# Altium schematic sheet Display Driver.SchDoc
size 431 x 279 mm; SheetNumber: 3; SheetTotal: 7
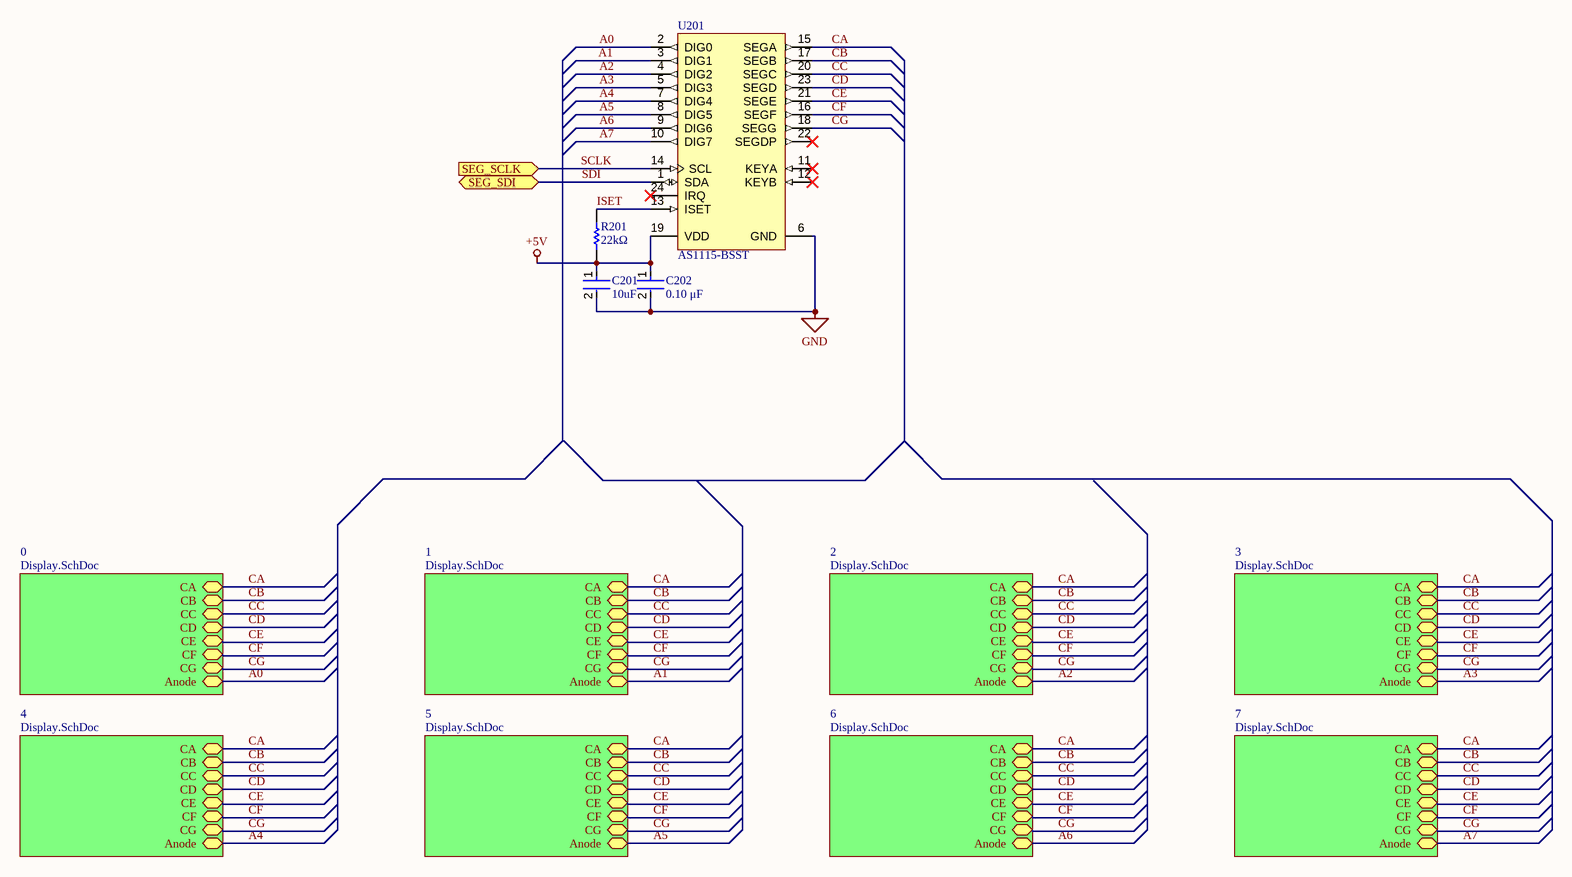
[diagram p0: Display Driver.SchDoc]

## Parts
C201  Capacitance: 10uF  [FP-C1206C-EH-MFG]  (hidden comment: C1206C106K4RACAUTO)
C202  Capacitance: 0.10 μF  [FP-C0603C-CF-MFG]  (hidden comment: C0603C104K5RACAUTO)
R201  Resistance: 22kΩ  [RESC1608X55X25LL10T15]  (hidden comment: RC0603FR-0722KL)
U201  AS1115-BSST  [AMS-QSOP-24-8645X3900DE_N]

## Sub-sheets
0 = Display.SchDoc: CA (bidir), CB (bidir), CC (bidir), CD (bidir), CE (bidir), CF (bidir), CG (bidir), Anode (bidir)
1 = Display.SchDoc: CA (bidir), CB (bidir), CC (bidir), CD (bidir), CE (bidir), CF (bidir), CG (bidir), Anode (bidir)
2 = Display.SchDoc: CA (bidir), CB (bidir), CC (bidir), CD (bidir), CE (bidir), CF (bidir), CG (bidir), Anode (bidir)
3 = Display.SchDoc: CA (bidir), CB (bidir), CC (bidir), CD (bidir), CE (bidir), CF (bidir), CG (bidir), Anode (bidir)
4 = Display.SchDoc: CA (bidir), CB (bidir), CC (bidir), CD (bidir), CE (bidir), CF (bidir), CG (bidir), Anode (bidir)
5 = Display.SchDoc: CA (bidir), CB (bidir), CC (bidir), CD (bidir), CE (bidir), CF (bidir), CG (bidir), Anode (bidir)
6 = Display.SchDoc: CA (bidir), CB (bidir), CC (bidir), CD (bidir), CE (bidir), CF (bidir), CG (bidir), Anode (bidir)
7 = Display.SchDoc: CA (bidir), CB (bidir), CC (bidir), CD (bidir), CE (bidir), CF (bidir), CG (bidir), Anode (bidir)

## Ports
SEG_SCLK (in), SEG_SDI (bidir)

## Nets
+5V: C201.1 C202.1 R201.1 U201.19(VDD)
GND: C201.2 C202.2 U201.6(GND)
A0: U201.2(DIG0) ; sheet 0/Anode
A1: U201.3(DIG1) ; sheet 1/Anode
A2: U201.4(DIG2) ; sheet 2/Anode
A3: U201.5(DIG3) ; sheet 3/Anode
A4: U201.7(DIG4) ; sheet 4/Anode
A5: U201.8(DIG5) ; sheet 5/Anode
A6: U201.9(DIG6) ; sheet 6/Anode
A7: U201.10(DIG7) ; sheet 7/Anode
CA: U201.15(SEGA) ; sheet 0/CA, sheet 1/CA, sheet 2/CA, sheet 3/CA, sheet 4/CA, sheet 5/CA, sheet 6/CA, sheet 7/CA
CB: U201.17(SEGB) ; sheet 0/CB, sheet 1/CB, sheet 2/CB, sheet 3/CB, sheet 4/CB, sheet 5/CB, sheet 6/CB, sheet 7/CB
CC: U201.20(SEGC) ; sheet 0/CC, sheet 1/CC, sheet 2/CC, sheet 3/CC, sheet 4/CC, sheet 5/CC, sheet 6/CC, sheet 7/CC
CD: U201.23(SEGD) ; sheet 0/CD, sheet 1/CD, sheet 2/CD, sheet 3/CD, sheet 4/CD, sheet 5/CD, sheet 6/CD, sheet 7/CD
CE: U201.21(SEGE) ; sheet 0/CE, sheet 1/CE, sheet 2/CE, sheet 3/CE, sheet 4/CE, sheet 5/CE, sheet 6/CE, sheet 7/CE
CF: U201.16(SEGF) ; sheet 0/CF, sheet 1/CF, sheet 2/CF, sheet 3/CF, sheet 4/CF, sheet 5/CF, sheet 6/CF, sheet 7/CF
CG: U201.18(SEGG) ; sheet 0/CG, sheet 1/CG, sheet 2/CG, sheet 3/CG, sheet 4/CG, sheet 5/CG, sheet 6/CG, sheet 7/CG
ISET: R201.2 U201.13(ISET)
SCLK: U201.14(SCL) ; port SEG_SCLK
SDI: U201.1(SDA) ; port SEG_SDI

Not connected (* = marked no-connect by the designer): U201 11(KEYA)* 12(KEYB)* 22(SEGDP)* 24(IRQ)*

## Notes on the sheet
- DWG. NO.
- REV.
- SHT.
- THIS DOCUMENT AND THE DATA DISCLOSED HEREIN OR HEREWITH IS THE PROPERTY OF ALTIUM LIMITED AND MAY BE FREELY DISTRIBUTED IN WHOLE. NO RIGHTS ARE RESERVED OR EXPRESS OR IMPLIED WARANTEE GIVEN.
- REVISION
- DESCRIPTION
- DATE
- APPROVED
- ENG:
- APPROVALS
- PROJECT
- DSN:
- CHK:
- REFERENCE DOCUMENTS
- PROJECT REVISION:
- TITLE
- DOCUMENT REVISION:
- DESIGN ITEM:
- BOM:
- FAB DWG:
- PCB DWG:
- ASSY DWG:
- SCALE:
- SIZE
- B
- CAGE CODE
- FILE NAME
- DWG NO.
- SHEET
- OF
- REV

## Library data of the parts
C201 = CMP-03020-003375-1: CAP CER 10UF 16V X7R 1206; Manufacturer: Kemet; Material: Ceramic; Temperature Coefficient: 15%; Tolerance: 10%; Automotive Grade: Grade 1; Manufacturer Part Number: C1206C106K4RACAUTO; Digikey Description: CAP CER 10UF 16V X7R 1206; RoHS: TRUE; Temperature Range Low: -55°C; Ipc Land Pattern Name: CAPC320160X160; Category: Cap; Mouser Description: Multilayer Ceramic Capacitors MLCC - SMD/SMT 10uF 16V 10% AUTO; Device Class L1: Passive Components; Automotive: Yes; ComponentLink2Description: Datasheet; Octopart: https://octopart.com/c1206c106k4racauto-kemet-20072893; Package: C1206C-EH; Temperature: -55°C to +125°C; Device Class L3: Ceramic Capacitors; Device Class L2: Capacitors; Temperature Range High: +125°C; Value: 10uF; Lead Free: Yes; Height: 1.8mm; Temperature Characteristic: X7R; ComponentLink2URL: https://content.kemet.com/datasheets/KEM_C1023_X7R_AUTO_SMD.pdf; Voltage Rating: 16V
C202 = CMP-2006-03060-2: CAP CER 0.1UF 50V X7R 0603; Manufacturer: KEMET; Tolerance: 0.1; Material: Ceramic; Value: 0.10 μF; Automotive Grade: Grade 1; Temperature Coefficient: 30ppm/°C; RoHS: TRUE; Temperature Range Low: -55°C; Automotive: Yes; Octopart: https://octopart.com/c0603c104k5racauto-kemet-12563741; Temperature Characteristic: X7R; Category: Cap; Voltage Rating: 50 V; Mouser Description: Multilayer Ceramic Capacitors MLCC - SMD/SMT 0.1uF 50volts 10% X7R AUTO; ComponentLink2Description: Datasheet; Device Class L2: Capacitors; Digikey Description: CAP CER 0.1UF 50V X7R 0603; Manufacturer Part Number: C0603C104K5RACAUTO; ComponentLink2URL: https://api.kemet.com/component-edge/download/datasheet/C0603C100J5GACAUTO.pdf; Lead Free: Yes; Height: 0.87mm; Device Class L3: Ceramic Capacitors; Device Class L1: Passive Components; Temperature Range High: +125°C; Package: C0603C-CF; Temperature: -55°C to +125°C
R201 = CMP-1012-00659-3: Chip Resistor, 22 KOhm, +/- 1%, 0.1 W, -55 to 155 degC, 0603 (1608 Metric), RoHS, Tape and Reel; Tolerance: 10%; Current Rating: 290 mA; Shielding: Unshielded; PackageReference: 0603; PackageDescription: 2-Pin Surface Mount Device, Body 1.6 x 0.8 mm; ComponentLink2URL: http://www.yageo.com/documents/recent/PYu-RC_Group_51_RoHS_L_04.pdf; RoHSCompliant: True; REACH SVHC: No SVHC; ComponentLink1Description: Manufacturer URL; ComponentLink2Description: Datasheet; DatasheetVersion: Rev. 4, 02/2016; Min Operating Temperature: -55degC; Pins: 2; Mount: Through Hole; Height: 11 mm; Packaging: Bulk; Radiation Hardening: No; Package Quantity: 100; Diameter: 8.5 mm; Lead Pitch: 5 mm; Case/Package: Radial; Max Operating Temperature: 105degC; ComponentLink1URL: http://www.yageo.com/
U201 = CMP-0558-00023-2: 64 LED + 16 Keys User Interface LED Driver, I2C Interface, 2.7 to 5.5 V, QSOP-24, Pb-Free, Reel; Manufacturer: AMS; Read-back: TRUE; LED Current per Output (mA): 5; Outputs: 64; LED-to-LED Matching (%): 3; ComponentLink1URL: www.ams.com; DatasheetVersion: Rev. 1.08; PackageVersion: Rev. 1.07, 04/2010; Supply Voltage (V): 2.7 to 5.5; PackageReference: QSOP-24; ComponentLink1Description: Manufacturer URL; Features: multiplexed; IÂ²C interface; PartNumber: AS1115-BSST; ComponentLink2Description: Datasheet; ComponentLink2URL: http://www.ams.com/eng/content/download/18430/343782/15670; Mounting Technology: Surface Mount; Error Detection: TRUE; PackageDescription: 24-Pin Small Outline Package, 8.645 x 3.9 mm Body, 0.635 mm Pitch